# Altium schematic sheet TEC_CONTROLLER_2.SchDoc: Laser PCB
size A3; DrawnBy: James Singleton; Organization: TMC Technology Ltd.; DocumentNumber: 12; Revision: A; SheetNumber: 11; SheetTotal: 18; Drawn Date: 22/12/2020
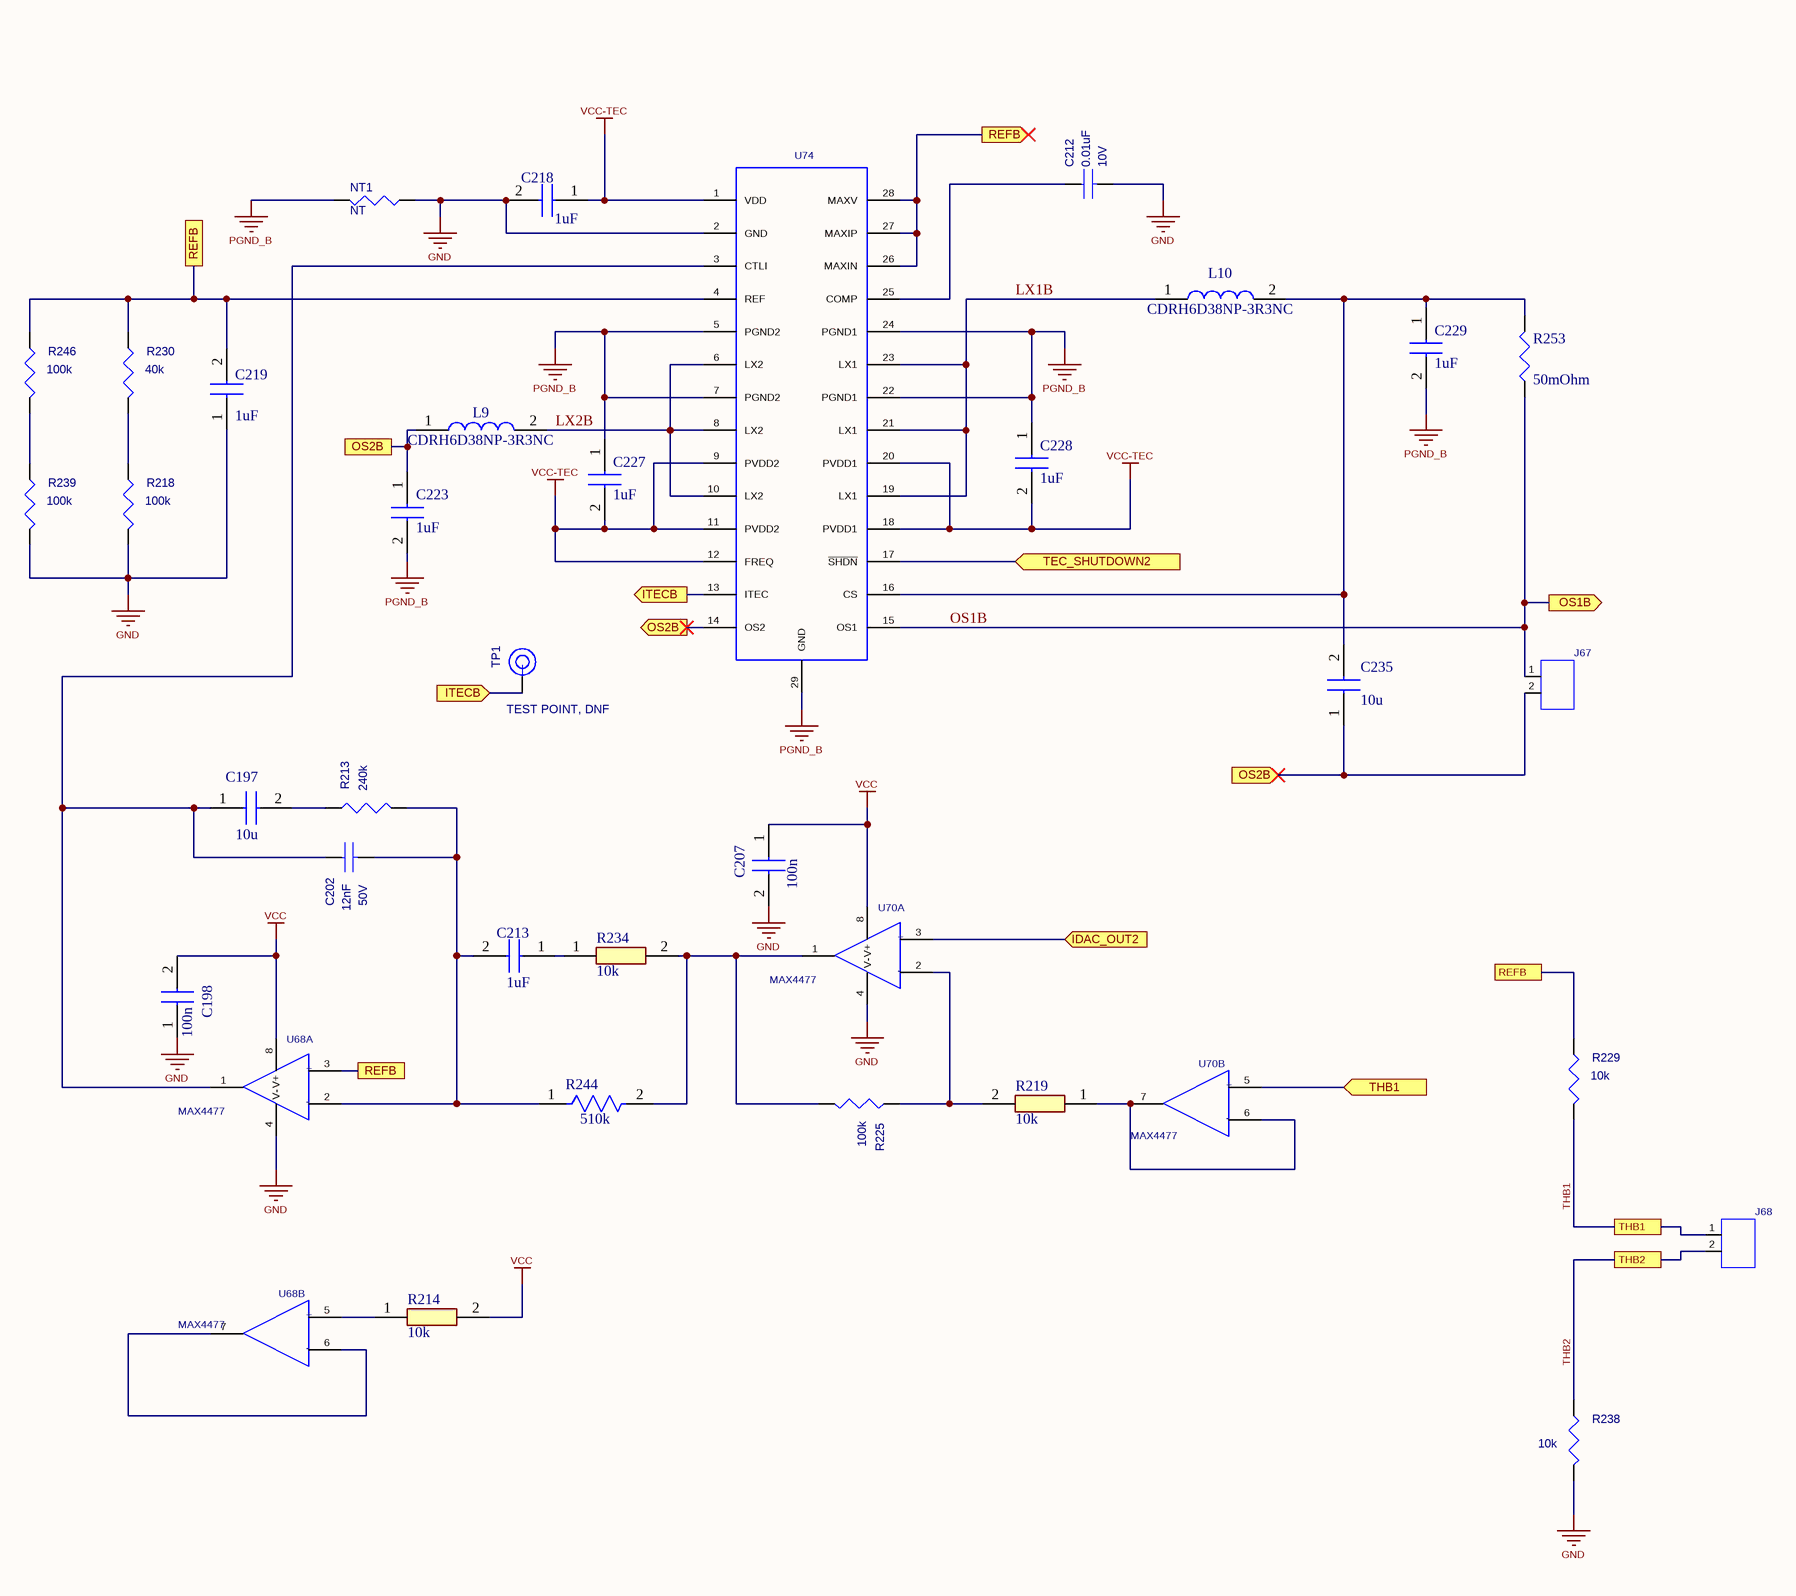
[diagram p0: TEC_CONTROLLER_2.SchDoc]

## Parts
C197  10u  [GRM18x]
C198  100n  [CAPC1608X90N]
C202  value 12nF  Rated_Voltage: 50V  [CC0603N]  (hidden comment: 12n)
C207  100n  [CAPC1608X90N]
C212  value 0.01uF  Rated_Voltage: 10V  [CC0603N]  (hidden comment: 10n)
C213  1uF  [CAPC1608X95N]
C218  1uF  [CAPC1608X95N]
C219  1uF  [CAPC1608X95N]
C223  1uF  [CAPC1608X95N]
C227  1uF  [CAPC1608X95N]
C228  1uF  [CAPC1608X95N]
C229  1uF  [CAPC1608X95N]
C235  10u  [GRM18x]
J67  CON02  [AE-6410-2W-VERTICAL]  (value not drawn)
J68  CON02  [AE-6410-2W-VERTICAL]  (value not drawn)
L9  CDRH6D38NP-3R3NC  [CDRH6D38NP3R3NC]
L10  CDRH6D38NP-3R3NC  [CDRH6D38NP3R3NC]
NT1  value NT  [NetTie]  (hidden comment: Net Tie)  (net tie, no BOM)
R213  240k  [CR0603N]
R214  10k  [RESC1608X55N]
R218  100k  [CR0603N]
R219  10k  [RESC1608X55N]
R225  100k  [CR0603N]
R229  value 10k  [CR0603N]  (hidden comment: RES)
R230  40k  [CR0603N]
R234  10k  [RESC1608X55N]
R238  value 10k  [CR0603N]  (hidden comment: RES)
R239  100k  [CR0603N]
R244  Resistance: 510k  [FP-CR0603-MFG]  (hidden comment: CR0603-JW-514ELF)
R246  100k  [CR0603N]
R253  value 50mOhm  [RESC3216X89N]  (hidden comment: PE1206FRE470R05L)
TP1  value TEST POINT, DNF  [MILLMAX3210]  (hidden comment: DNF)
U68  MAX4477  [SOP65P490X110-8CN]  (parts A,B of 2)
U70  MAX4477  [SOP65P490X110-8CN]  (parts A,B of 2)
U74  (no value)  [SOP65P638X110-29N]

## Ports
IDAC_OUT2 (in, see TEC_CONTROLLER_1[8A]), ITECB (in, see TEC_CONTROLLER_1[7C], TEC_CONTROLLER_2[3B]), ITECB (out, see TEC_CONTROLLER_1[7C], TEC_CONTROLLER_2[2B]), OS1B (out), OS2B (in, see TEC_CONTROLLER_2[2B], TEC_CONTROLLER_2[3B]), OS2B (out, see TEC_CONTROLLER_2[2B], TEC_CONTROLLER_2[5C]), OS2B (see TEC_CONTROLLER_2[3B], TEC_CONTROLLER_2[5C]), REFB (out, see TEC_CONTROLLER_2[1A], TEC_CONTROLLER_2[2C], TEC_CONTROLLER_2[5C]), REFB (see TEC_CONTROLLER_2[1A], TEC_CONTROLLER_2[2C], TEC_CONTROLLER_2[4A]), REFB (see TEC_CONTROLLER_2[1A], TEC_CONTROLLER_2[4A], TEC_CONTROLLER_2[5C]), REFB (see TEC_CONTROLLER_2[2C], TEC_CONTROLLER_2[4A], TEC_CONTROLLER_2[5C]), TEC_SHUTDOWN2 (in, see PIO[2C]), THB1 (in, see TEC_CONTROLLER_1[7B], TEC_CONTROLLER_2[6D]), THB1 (see TEC_CONTROLLER_1[7B], TEC_CONTROLLER_2[5C]), THB2

## Nets
GND: C198.1 C207.2 C212.2 C218.2 C219.1 NT1.2 R218.2 R238.2 R239.2 U68.4(V-) U70.4(V-) U74.2(GND)
PGND_B: C223.2 C227.1 C228.1 C229.2 NT1.1 U74.5(PGND2) U74.7(PGND2) U74.22(PGND1) U74.24(PGND1) U74.29(GND)
VCC: C198.2 C207.1 R214.2 U68.8(V+) U70.8(V+)
VCC-TEC: C218.1 C227.2 C228.2 U74.1(VDD) U74.9(PVDD2) U74.11(PVDD2) U74.12(FREQ) U74.18(PVDD1) U74.20(PVDD1)
IDAC_OUT2: U70.3 ; port IDAC_OUT2
ITECB: TP1.1 U74.13(ITEC) ; port ITECB
LX1B: L10.1 U74.19(LX1) U74.21(LX1) U74.23(LX1)
LX2B: L9.2 U74.6(LX2) U74.8(LX2) U74.10(LX2)
OS1B: J67.1 R253.1 U74.15(OS1) ; port OS1B
OS2B: C223.1 C235.1 J67.2 L9.1 U74.14(OS2) ; port OS2B
REFB: C219.2 R229.1 R230.1 R246.1 U68.3 U74.4(REF) U74.26(MAXIN) U74.27(MAXIP) U74.28(MAXV) ; port REFB
TEC_SHUTDOWN2: U74.17(~{SHDN}) ; port TEC_SHUTDOWN2
THB1: J68.1 R229.2 U70.5 ; port THB1
THB2: J68.2 R238.1 ; port THB2
NetC197_1: C197.1 C202.1 U68.1 U74.3(CTLI)
NetC197_2: C197.2 R213.1
NetC202_2: C202.2 C213.2 R213.2 R244.1 U68.2
NetC212_1: C212.1 U74.25(COMP)
NetC213_1: C213.1 R234.1
NetC229_1: C229.1 C235.2 L10.2 R253.2 U74.16(CS)
NetR214_1: R214.1 U68.5
NetR218_1: R218.1 R230.2
NetR219_1: R219.1 U70.6 U70.7
NetR219_2: R219.2 R225.1 U70.2
NetR225_2: R225.2 R234.2 R244.2 U70.1
NetR239_1: R239.1 R246.2
NetU68_6: U68.6 U68.7

## Notes on the sheet
- TMC Technology Ltd.
- Page Contents:
- Project:
- Variant:
- Checked By:
- Size:
- Date:
- Dwg No:
- Sheet
- of
- Revision:
- (in symbol MAX4477, part A) +; -
- (in symbol MAX4477, part B) +; -

## Library data of the parts
C197 C235 = GRM188Z71A106MA73J: Capacitor; Manufacturer_Name: Murata Electronics; Datasheet Link: https://search.murata.co.jp/Ceramy/image/img/A01X/G101/ENG/GRM188Z71A106MA73-01A.pdf; Height: 0.8mm; Manufacturer_Part_Number: GRM188Z71A106MA73J; Mouser Part Number: 81-GRM188Z71A106MA3J; Mouser Price/Stock: https://www.mouser.com/Search/Refine.aspx?Keyword=81-GRM188Z71A106MA3J; Arrow Part Number: GRM188Z71A106MA73J; Arrow Price/Stock: https://www.arrow.com/en/products/grm188z71a106ma73j/murata-manufacturing; ClassName: TEC2
C198 C207 = CL10B104KB85PNC: Capacitor; Manufacturer_Name: SAMSUNG; Datasheet Link: https://product.samsungsem.com/mlcc/CL10B104KB85PN.do; Height: 0.9mm; Manufacturer_Part_Number: CL10B104KB85PNC; Mouser Part Number: 187-CL10B104KB85PNC; Mouser Price/Stock: https://www.mouser.co.uk/ProductDetail/Samsung-Electro-Mechanics/CL10B104KB85PNC?qs=349EhDEZ59rqeQxdKfSn5w%3D%3D; Arrow Part Number: CL10B104KB85PNC; Arrow Price/Stock: https://www.arrow.com/en/products/cl10b104kb85pnc/samsung-electro-mechanics; ClassName: TEC2
C202 = CAP: Cap., 0.012µF ±10% 50V Ceramic X7R 0603 (1608 Metric); PART_NUMBER: 478-1228-1-ND; Manufacturer: AVX; Manufacturer_PN: 06035C123KAT2A; FPLIST: CC0603N,CC0603L,CC0603M; Dielectric_Type: X5R; CLASS: DISCRETE; Source_Path: \\MIL-NS1\CIP\SCHEMATIC_SYMBOLS\LTC_CAPACITOR.OLB; Geometry.Height: 37.40mil; Package_Size: 0603; Package_Type: SMD; Tolerance: 10%; PCB DECAL: CC0603N; ClassName: TEC2
C212 = CAP: CAP.,0.01uF,X5R,10V,10%,0603; Manufacturer_PN: 0603ZD103KAT2A; Manufacturer: AVX; CLASS: DISCRETE; FPLIST: CC0603N,CC0603L,CC0603M; Source_Path: \\MIL-NS1\CIP\SCHEMATIC_SYMBOLS\LTC_CAPACITOR.OLB; Geometry.Height: 37.40mil; Tolerance: 10%; Dielectric_Type: X5R; Package_Size: 0603; PCB DECAL: CC0603N; ClassName: TEC2
C213 C218 C219 C223 C227-C229 = CL10B105KB8NQNC: Capacitor; Manufacturer_Name: SAMSUNG; Datasheet Link: https://product.samsungsem.com/mlcc/CL10B105KB8NQN.do; Height: 0.95mm; Manufacturer_Part_Number: CL10B105KB8NQNC; Mouser Part Number: 187-CL10B105KB8NQNC; Mouser Price/Stock: https://www.mouser.co.uk/ProductDetail/Samsung-Electro-Mechanics/CL10B105KB8NQNC?qs=Jm2GQyTW%2FbjBq1uiSyA2AQ%3D%3D; Arrow Part Number: CL10B105KB8NQNC; Arrow Price/Stock: https://www.arrow.com/en/products/cl10b105kb8nqnc/samsung-electro-mechanics?region=europe; ClassName: TEC2
J67 J68 = CON02: 2 pin Connector; Manufacturer: Molex; UNNAMED1: DNF; Order No: 1360130; PCB DECAL: AE-6410-2W-VERTICAL; Part No: 22-29-2021; ClassName: TEC2
  J68: System: Connector
L9 L10 = CDRH6D38NP-3R3NC: Inductor; Manufacturer_Name: Sumida; Datasheet Link: http://products.sumida.com/products/pdf/CDRH6D38.pdf; Manufacturer_Part_Number: CDRH6D38NP-3R3NC; Mouser Part Number: 851-CDRH6D38NP-3R3NC; Mouser Price/Stock: https://www.mouser.co.uk/ProductDetail/Sumida/CDRH6D38NP-3R3NC?qs=yEEOfDmvQDXre4MvBRE7jQ%3D%3D; Arrow Part Number: CDRH6D38NP-3R3NC; Arrow Price/Stock: https://www.arrow.com/en/products/cdrh6d38np-3R3nc/sumida?region=nac; Height: 4mm
NT1 = NetTie: Manufacturer_PN: ERJ3EKF1002V; Manufacturer: PANASONIC; Part No: P10.0KHCT-ND; PCB DECAL: CR0603N; CLASS: DISCRETE; Rated_Power: 1/10W; Tolerance: 1%; Temperature_Coefficient: 100ppm/C; FPLIST: CR0603N,CR0603L,CR0603M; Source_Path: \\MIL-NS1\CIP\SCHEMATIC_SYMBOLS\LTC_RESISTOR.OLB; Geometry.Height: 37.40mil; Package_Size: 0603
R213 = RES: RES.,240k OHMS,1%,1/10W,0603; Manufacturer: PANASONIC; CLASS: DISCRETE; Temperature_Coefficient: 100ppm/C; FPLIST: CR0603N,CR0603L,CR0603M; Source_Path: \\MIL-NS1\CIP\SCHEMATIC_SYMBOLS\LTC_RESISTOR.OLB; Geometry.Height: 37.40mil; PCB DECAL: CR0603N; Rated_Power: 1/10W; Tolerance: 1%; Package_Size: 0603; Value: 240k; ClassName: TEC2
R214 R219 R234 = CR0603-JW-103ELF: Resistor; Manufacturer_Name: Bourns; Datasheet Link: https://www.bourns.com/pdfs/chpreztr.pdf; Height: 0.55mm; Manufacturer_Part_Number: CR0603-JW-103ELF; Mouser Part Number: 652-CR0603-JW-103ELF; Mouser Price/Stock: https://www.mouser.co.uk/ProductDetail/Bourns/CR0603-JW-103ELF?qs=tprK%2FdUq6q6vORSl%252Bpo4rg%3D%3D; Arrow Part Number: CR0603-JW-103ELF; Arrow Price/Stock: https://www.arrow.com/en/products/cr0603-jw-103elf/bourns?utm_currency=USD&region=nac
R218 R225 R239 R246 = RES: RES.,100k OHMS,1%,1/10W,0603; Manufacturer_PN: ERJ3EKF1003V; Manufacturer: PANASONIC; PART_NUMBER: P100KHCT-ND; CLASS: DISCRETE; Temperature_Coefficient: 100ppm/C; FPLIST: CR0603N,CR0603L,CR0603M; Source_Path: \\MIL-NS1\CIP\SCHEMATIC_SYMBOLS\LTC_RESISTOR.OLB; Geometry.Height: 37.40mil; PCB DECAL: CR0603N; Rated_Power: 1/10W; Tolerance: 1%; Package_Size: 0603; Value: 100k; ClassName: TEC2
R229 R238 = RES: RES.,10k OHMS,1%,1/10W,0603; Manufacturer_PN: ERJ3EKF1002V; Manufacturer: PANASONIC; Part No: P10.0KHCT-ND; CLASS: DISCRETE; Temperature_Coefficient: 100ppm/C; FPLIST: CR0603N,CR0603L,CR0603M; Source_Path: \\MIL-NS1\CIP\SCHEMATIC_SYMBOLS\LTC_RESISTOR.OLB; Geometry.Height: 37.40mil; PCB DECAL: CR0603N; Rated_Power: 1/10W; Tolerance: 1%; Package_Size: 0603; ClassName: TEC2
R230 = RES: RES.,40k OHMS,1%,1/10W,0603; Manufacturer_PN: CRCW0603560KFKEA; Manufacturer: VISHAY; PART_NUMBER: 2138575; CLASS: DISCRETE; Temperature_Coefficient: 100ppm/C; FPLIST: CR0603N,CR0603L,CR0603M; Source_Path: \\MIL-NS1\CIP\SCHEMATIC_SYMBOLS\LTC_RESISTOR.OLB; Geometry.Height: 37.40mil; PCB DECAL: CR0603N; Rated_Power: 1/10W; Tolerance: 1%; Package_Size: 0603; Value: 40k; ClassName: TEC2
R244 = CMP-07231-004798-1: Thick Film Chip Resistors 0603 510kΩ 0.1W 5% 200ppm/°C; Max Power Dissipation: 100mW; Voltage Rating: 50V; Number of Terminations: 2; Radiation Hardening: No; Features: Moisture Resistant; Military Standard: Not; Width: 0.031inch; Case Code (Imperial): 0603; Tolerance: 5%; Height: 0.022inch; Min Operating Temperature: -55°C; Packaging: Tape and Reel; Case Code (Metric): 1608; Contact Plating: Tin; Mount: Surface Mount; Max Operating Temperature: 155°C; Length: 1.6mm; Temperature Coefficient: 200ppm/°C; Power Rating: 100mW; Depth: 0.8mm; Termination: SMD/SMT; Composition: Thick Film; Package Quantity: 5000; Thickness: 457um; Case/Package: 0603
R253 = PE1206FRE470R05L: Resistor; Manufacturer_Name: YAGEO; Datasheet Link: https://www.yageo.com/upload/media/product/productsearch/datasheet/rchip/PYu-PE_521_RoHS_L_10.pdf; Height: 0.89mm; Manufacturer_Part_Number: PE1206FRE470R05L; Mouser Part Number: 603-PE1206FRE470R05L; Mouser Price/Stock: https://www.mouser.co.uk/ProductDetail/YAGEO/PE1206FRE470R05L?qs=eP2BKZSCXI5fQbfM3JSqUA%3D%3D
TP1 = MILLMAX3210: TEST POINT,TURRET,0.031",MTG. HOLE; Manufacturer_PN: 3210-2-00-01-00-00-08-0; Manufacturer: MILL-MAX; PART_FIELD_01: GND; Source_Path: \\MIL-NS1\CIP\SCHEMATIC_SYMBOLS\LTC_HARDWARE.OLB; CLASS: IO; PCB DECAL: MILLMAX3210; ClassName: TEC2
U68 U70 = MAX4477: Manufacturer: Maxim; Part No: MAX4477AUA+; Geometry.Height: 1.1mm; Order No: 2510956; PCB DECAL: SOP65P490X110-8CN; ClassName: TEC2
U74 = MAX1968: Thermoelectric Cooler PMIC 28-TSSOP-EP; Part No: MAX1969; Manufacturer: Maxim; Geometry.Height: 1.1mm; Order No: 2514258; PCB DECAL: SOP65P638X110-29N; ClassName: TEC2